# Altium project DataLoger.PrjPcb
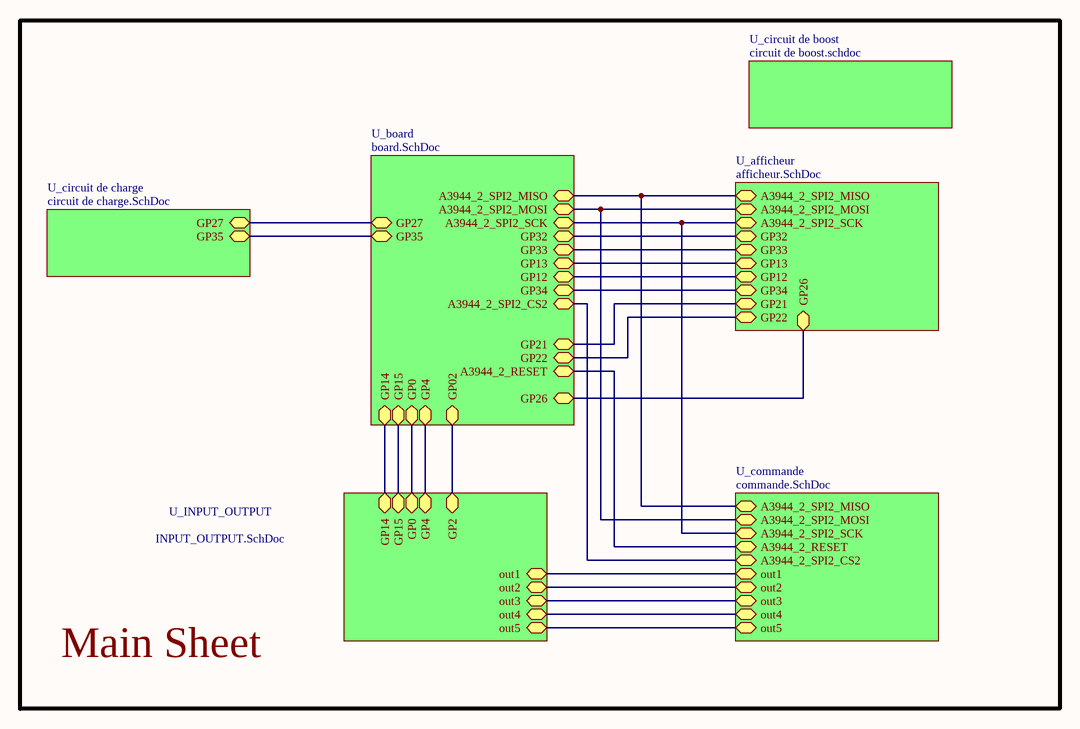
[diagram p0: main.SchDoc]
7 sheets, 81 parts. Net scope: hierarchical (ports join the sheet entries above them; power ports are global).
Board file: PCB final (2).PcbDoc
Sheets:
  main.SchDoc
    U_circuit de boost = circuit de boost.schdoc
    U_board = board.SchDoc
    U_circuit de charge = circuit de charge.SchDoc
    U_INPUT_OUTPUT = INPUT_OUTPUT.SchDoc
    U_commande = commande.SchDoc
    U_afficheur = afficheur.SchDoc

## Sheet main.SchDoc
size A4; SheetNumber: 1; SheetTotal: 7

### Sub-sheets
U_afficheur = afficheur.SchDoc: A3944_2_SPI2_MISO (bidir), A3944_2_SPI2_MOSI (bidir), A3944_2_SPI2_SCK (bidir), GP32 (bidir), GP33 (bidir), GP13 (bidir), GP12 (bidir), GP34 (bidir), GP21 (bidir), GP22 (bidir), GP26 (bidir)
U_board = board.SchDoc: A3944_2_SPI2_MOSI (bidir), GP22 (bidir), GP21 (bidir), A3944_2_SPI2_CS2 (bidir), GP27 (bidir), A3944_2_SPI2_MISO (bidir), A3944_2_SPI2_SCK (bidir), GP4 (bidir), GP0 (bidir), GP14 (bidir), A3944_2_RESET (bidir), GP33 (bidir), GP32 (bidir), GP34 (bidir), GP12 (bidir), GP13 (bidir), GP02 (bidir), GP15 (bidir), GP35 (bidir), GP26 (bidir)
U_circuit de boost = circuit de boost.schdoc: no entries
U_circuit de charge = circuit de charge.SchDoc: GP27 (bidir), GP35 (bidir)
U_commande = commande.SchDoc: A3944_2_RESET (bidir), A3944_2_SPI2_MISO (bidir), A3944_2_SPI2_SCK (bidir), A3944_2_SPI2_MOSI (bidir), A3944_2_SPI2_CS2 (bidir), out1 (bidir), out2 (bidir), out3 (bidir), out4 (bidir), out5 (bidir)
U_INPUT_OUTPUT = INPUT_OUTPUT.SchDoc: GP15 (bidir), GP14 (bidir), GP4 (bidir), GP0 (bidir), out1 (bidir), out2 (bidir), out3 (bidir), out4 (bidir), out5 (bidir), GP2 (bidir)

### Nets
A3944_2_SPI2_MISO: sheet U_board/A3944_2_SPI2_MISO, sheet U_commande/A3944_2_SPI2_MISO, sheet U_afficheur/A3944_2_SPI2_MISO
A3944_2_SPI2_MOSI: sheet U_board/A3944_2_SPI2_MOSI, sheet U_commande/A3944_2_SPI2_MOSI, sheet U_afficheur/A3944_2_SPI2_MOSI
A3944_2_SPI2_SCK: sheet U_board/A3944_2_SPI2_SCK, sheet U_commande/A3944_2_SPI2_SCK, sheet U_afficheur/A3944_2_SPI2_SCK
GP35: sheet U_board/GP35, sheet U_circuit de charge/GP35
out1: sheet U_INPUT_OUTPUT/out1, sheet U_commande/out1
out2: sheet U_INPUT_OUTPUT/out2, sheet U_commande/out2
out3: sheet U_INPUT_OUTPUT/out3, sheet U_commande/out3
out4: sheet U_INPUT_OUTPUT/out4, sheet U_commande/out4
out5: sheet U_INPUT_OUTPUT/out5, sheet U_commande/out5
NetB5_2: sheet U_board/GP26, sheet U_afficheur/GP26
NetJ1_2: sheet U_board/GP15, sheet U_INPUT_OUTPUT/GP15
NetJ2_2: sheet U_board/GP14, sheet U_INPUT_OUTPUT/GP14
NetJ3_2: sheet U_board/GP02, sheet U_INPUT_OUTPUT/GP2
NetJ4_2: sheet U_board/GP4, sheet U_INPUT_OUTPUT/GP4
NetJ5_2: sheet U_board/GP0, sheet U_INPUT_OUTPUT/GP0
NetP1_A1: sheet U_board/GP22, sheet U_afficheur/GP22
NetP1_B1: sheet U_board/GP32, sheet U_afficheur/GP32
NetP1_B4: sheet U_board/GP33, sheet U_afficheur/GP33
NetP1_B10: sheet U_board/GP21, sheet U_afficheur/GP21
NetP1_B11: sheet U_board/GP34, sheet U_afficheur/GP34
NetP1_B12: sheet U_board/GP12, sheet U_afficheur/GP12
NetR40_2: sheet U_board/GP13, sheet U_afficheur/GP13
NetR54_1: sheet U_board/GP27, sheet U_circuit de charge/GP27
NetU4_23: sheet U_board/A3944_2_SPI2_CS2, sheet U_commande/A3944_2_SPI2_CS2
NetU4_27: sheet U_board/A3944_2_RESET, sheet U_commande/A3944_2_RESET

### Notes on the sheet
- Labels drawn without touching a wire or pin: Main Sheet

## Sheet circuit de boost.schdoc
size A4; SheetNumber: 7; SheetTotal: 7
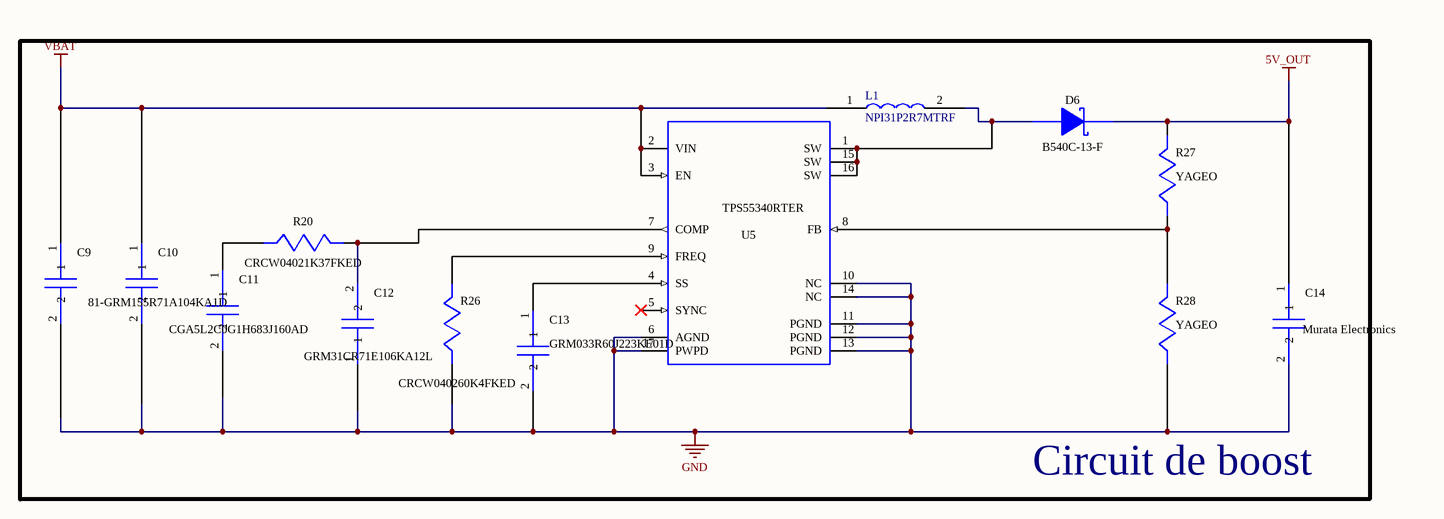
[diagram p1: circuit de boost.schdoc]

### Parts
C9  GRM31CR71E106KA12L  [GRM31CR71E106KA12L]  (value not drawn)
C10  Supplier réf: 81-GRM155R71A104KA1D  [GRM155R71A104KA01D]  (hidden comment: GRM155R71A104KA01D)
C11  CGA5L2C0G1H683J160AD  [CGA5L2C0G1H683J160AD]
C12  Mfr réf: GRM31CR71E106KA12L  [GRM2195C1H152JA01L]  (hidden comment: GRM2195C1H152JA01D)
C13  GRM033R60J223KE01D  [GRM033R60J223KE01D]
C14  Mfr: Murata Electronics  [GRM32EC80J107ME20L]  (hidden comment: GRM32EC80J107ME20L)
D6  B540C-13-F  [B540C-13-F]
L1  NPI31P2R7MTRF  [NPI31P2R7MTRF]
R20  CRCW04021K37FKED  [CRCW04021K37FKED]
R26  CRCW040260K4FKED  [CRCW040260K4FKED]
R27  Mfr: YAGEO  [RT0805BRD0730K5L]  (hidden comment: RT0805BRD0730K5L)
R28  Mfr: YAGEO  [RC0201FR-0710KL]  (hidden comment: RC0201FR-0710KL)
U5  TPS55340RTER  [TPS55340RTER]

### Blocks framed on the sheet
Circuit de boost: C9-C14 D6 L1 R20 R26-R28 U5

### Nets
5V_OUT: C14.1 D6.1(K) R27.1
GND: C9.2 C10.2 C11.2 C12.1 C13.2 C14.2 R26.2 R28.2 U5.6(AGND) U5.10(NC) U5.11(PGND) U5.12(PGND) U5.13(PGND) U5.14(NC) U5.17(PWPD)
VBAT: C9.1 C10.1 L1.1 U5.2(VIN) U5.3(EN)
NetC11_1: C11.1 R20.2
NetC12_2: C12.2 R20.1 U5.7(COMP)
NetC13_1: C13.1 U5.4(SS)
NetD6_2: D6.2(A) L1.2 U5.1(SW) U5.15(SW) U5.16(SW)
NetR26_1: R26.1 U5.9(FREQ)
NetR27_2: R27.2 R28.1 U5.8(FB)

Not connected (* = marked no-connect by the designer): U5 5(SYNC)*

### Library data of the parts
C9 = GRM31CR71E106KA12L: Multilayer Ceramic Capacitors MLCC - SMD/SMT 10 uF 25 VDC 10% 1206 X7R; Mfr: MuRata; Mfr réf: GRM31CR71E106KA12L; Supplier: Mouser; Supplier réf: 81-GRM31CR71E106KA12; Footprint: C1206; Price: 0.29$
C10 = GRM155R71A104KA01D: Multilayer Ceramic Capacitors MLCC - SMD/SMT 0.1 uF 10 VDC 10% 0402 X7R; Mfr: Murata; Mfr réf: GRM155R71A104KA01D; Supplier: mouser; Price: 0.09$
C11 = CGA5L2C0G1H683J160AD: Multilayer Ceramic Capacitors MLCC - SMD/SMT 1206 50V 0.068uF C0G 5% AEC-Q200 EPXY; Mfr: TDK; Supplier: mouser; Supplier réf: 810-CGA5L2C0G1H683JD; Mfr réf: CGA5L2C0G1H683J160AD; Footprint: *; Price: 0.73$
C12 = GRM2195C1H152JA01D: Multilayer Ceramic Capacitors MLCC - SMD/SMT 10 uF 25 VDC 10% 1206 X7R; Mfr: MuRata; Supplier: mouser; Supplier réf: 490-6518-6-ND; Price: 0.29$
C13 = GRM033R60J223KE01D: Multilayer Ceramic Capacitors MLCC - SMD/SMT 0.022 uF 6.3 VDC 10% 0201 X5R; Mfr: MuRata; Supplier: Mouser; Supplier réf: 81-GRM033R60J223KE1D; Mfr réf: GRM033R60J223KE01D; Price: 0.09$
C14 = GRM32EC80J107ME20L: Multilayer Ceramic Capacitors MLCC - SMD/SMT 100 uF 6.3 VDC 20% 1210 X6S; Supplier: Mouser; Supplier réf: 81-GRM32EC80J107ME0L; Mfr réf: GRM32EC80J107ME20L; Footprint: C1210; Price: 1.33$
D6 = B540C-13-F: Schottky Diodes & Rectifiers 40V 5A; Mfr: Diodes Incorporated; Supplier: Mouser; Supplier réf: 621-B540C-F; Mfr réf: B540C-13-F; Footprint: B540C; Price: 0.43$
L1 = NPI31P2R7MTRF: Power Inductor (SMD), 2.7 uH, ± 20%, 6.6 A, Unshielded, 7 A, 13.2mm x 9.9mm x 6.4mm; Mfr: NIC; Supplier: Exshine Technology; Supplier réf: EX-NPI31P2R7MTRF; Mfr réf: NPI31P2R7MTRF; Price: 0.37$
R20 = CRCW04021K37FKED: Thick Film Resistors - SMD 1/16watt 1.37Kohms 1%; Mfr: Vishay Dale; Supplier: mouser; Supplier réf: 71-CRCW0402-1.37K-E3; Mfr réf: CRCW04021K37FKED; Price: 0.093$
R26 = CRCW040260K4FKED: Thick Film Resistors - SMD 1/16watt 60.4Kohms 1%; Mfr: Vishay-Dale; Supplier: Digikey; Supplier réf: 541-60.4KLDKR-ND; Mfr réf: CRCW040260K4FKED; Price: 0.10$
R27 = RT0805BRD0730K5L: Thin Film Resistors - SMD 1/8W 30.5K Ohms 0.1%; Supplier: Mouser; Supplier réf: 603-RT0805BRD0730K5L; Mfr réf: RT0805BRD0730K5L; Footprint: R0805; Price: 0.15$
R28 = RC0201FR-0710KL: Thick Film Resistors - SMD 10 kOhms 50mW 0201 1%; Supplier: mouser; Supplier réf: 603-RC0201FR-0710KL; Mfr réf: RC0201FR-0710KL; Footprint: RC0201; Price: 0.09$
U5 = TPS55340RTER: Switching Voltage Regulators 5A 40V Wide In Range DC-DC Converter; Mfr: Texas Instruments; Supplier réf: 595-TPS55340RTER; Mfr réf: TPS55340RTER; Price: 15$

## Sheet board.SchDoc
size A4; SheetNumber: 2; SheetTotal: 7
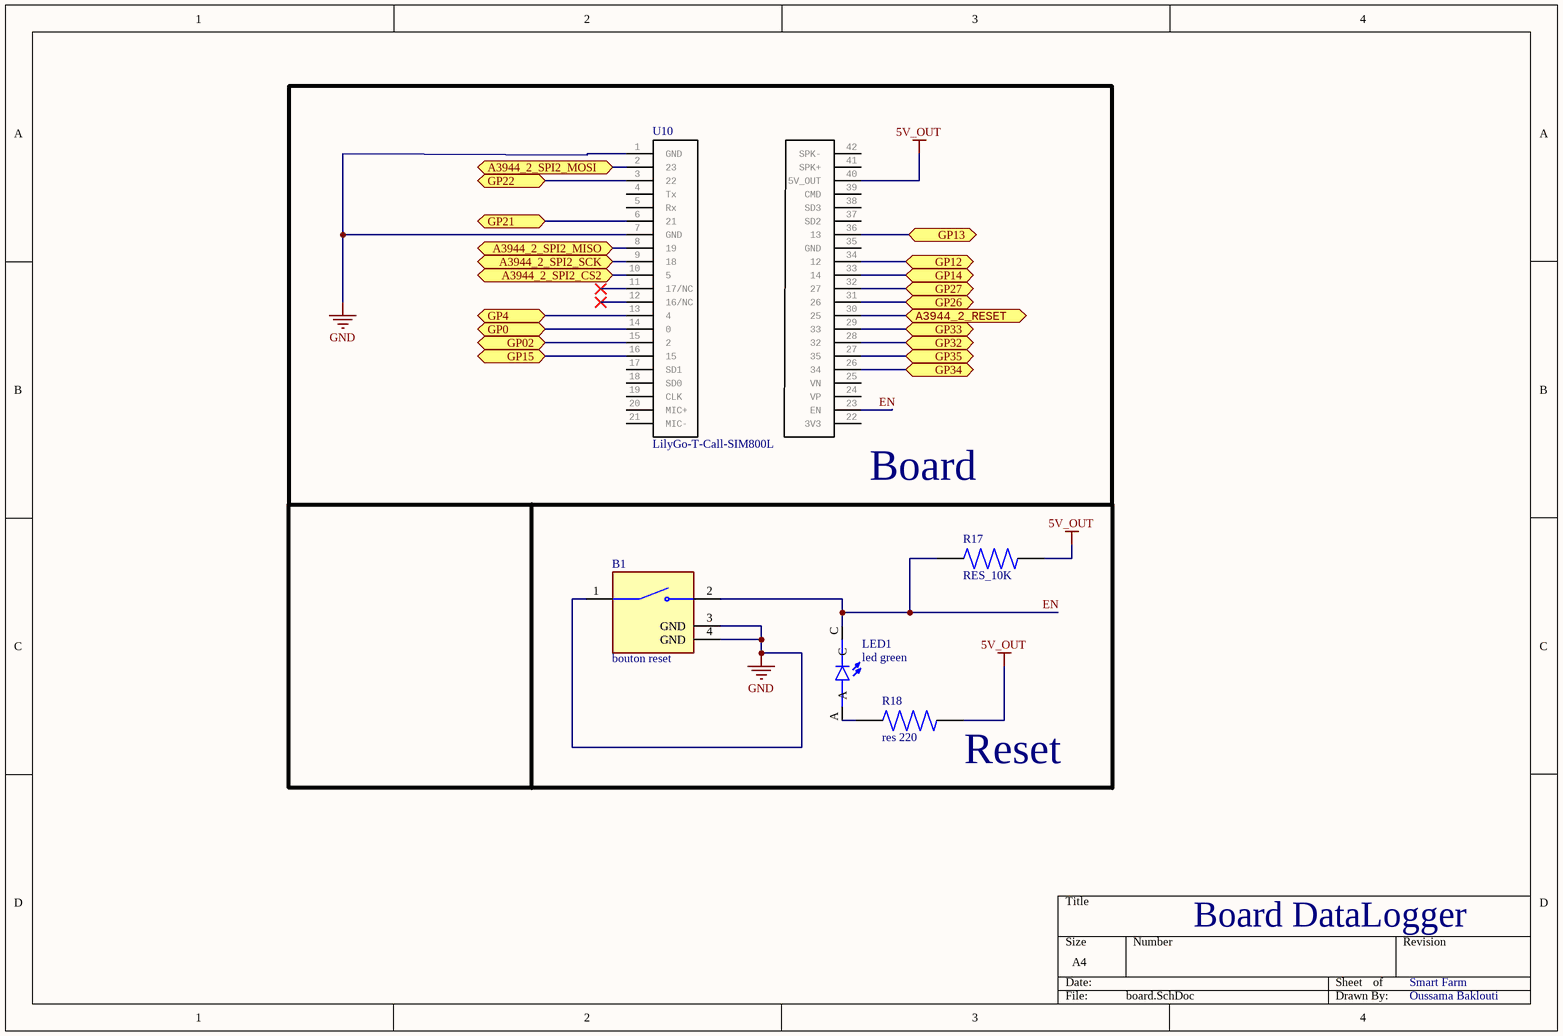
[diagram p2: board.SchDoc]

### Parts
B1  bouton reset  [button]
LED1  led green  [led green]
R17  RES_10K  [RES_10k]
R18  res 220  [res 220]
U10  LilyGo-T-Call-SIM800L  [LilyGo-T-Call-SIM800L]

### Blocks framed on the sheet
Board: U10

### Ports
A3944_2_RESET (bidir), A3944_2_SPI2_CS2 (bidir), A3944_2_SPI2_MISO (bidir), A3944_2_SPI2_MOSI (bidir), A3944_2_SPI2_SCK (bidir), GP0 (bidir), GP02 (bidir), GP4 (bidir), GP12 (bidir), GP13 (bidir), GP14 (bidir), GP15 (bidir), GP21 (bidir), GP22 (bidir), GP26 (bidir), GP27 (bidir), GP32 (bidir), GP33 (bidir), GP34 (bidir), GP35 (bidir)

### Nets
5V_OUT: R17.2 R18.2 U10.40(5V_OUT)
GND: B1.1(COM) B1.3(GND) B1.4(GND) U10.1(GND) U10.7(GND)
A3944_2_SPI2_MISO: U10.8(19) ; port A3944_2_SPI2_MISO
A3944_2_SPI2_MOSI: U10.2(23) ; port A3944_2_SPI2_MOSI
A3944_2_SPI2_SCK: U10.9(18) ; port A3944_2_SPI2_SCK
EN: B1.2(NO) LED1.C R17.1 U10.23(EN)
GP35: U10.27(35) ; port GP35
NetB5_2: U10.31(26) ; port GP26
NetJ1_2: U10.16(15) ; port GP15
NetJ2_2: U10.33(14) ; port GP14
NetJ3_2: U10.15(2) ; port GP02
NetJ4_2: U10.13(4) ; port GP4
NetJ5_2: U10.14(0) ; port GP0
NetLED1_A: LED1.A R18.1
NetP1_A1: U10.3(22) ; port GP22
NetP1_B1: U10.28(32) ; port GP32
NetP1_B4: U10.29(33) ; port GP33
NetP1_B10: U10.6(21) ; port GP21
NetP1_B11: U10.26(34) ; port GP34
NetP1_B12: U10.34(12) ; port GP12
NetR40_2: U10.36(13) ; port GP13
NetR54_1: U10.32(27) ; port GP27
NetU4_23: U10.10(5) ; port A3944_2_SPI2_CS2
NetU4_27: U10.30(25) ; port A3944_2_RESET

Not connected (* = marked no-connect by the designer): U10 4(Tx) 5(Rx) 11(17/NC)* 12(16/NC)* 17(SD1) 18(SD0) 19(CLK) 20(MIC+) 21(MIC-) 22(3V3) 24(VP) 25(VN) 35(GND) 37(SD2) 38(SD3) 39(CMD) 41(SPK+) 42(SPK-)

### Notes on the sheet
- (near R18) Reset
- Board DataLogger
- Smart Farm
- Oussama Baklouti

### Library data of the parts
B1 = bouton reset: Mfr: CUI Devices; Mfr réf: TS11-674-120-BK-260-RA-D; Supplier: DigiKey; Supplier réf: 2223-TS11-674-120-BK-260-RA-D-ND
LED1 = led green: Mfr: Lumex Opto/Components Inc.; Mfr réf: SSF-LXH305GD-TR; Supplier: DigiKey; Supplier réf: 67-1375-6-ND
R17 = RES_10K: Thick Film Resistors - SMD ResHighPowerA 0805 10k 1% 1/2W TC100; Mfr: Bourns Inc.; Mfr réf: CMP0805AFX-1002ELF; Supplier: Mouser; Supplier réf: 652-CMP0805AFX-1002L; Footprint: R0805
R18 = res 220: Thick Film Resistors - SMD 1/2watt 220ohms 1% High Power AEC-Q200; Mfr: Vishay Dale; Mfr Réf: CRCW0805220RFKEAHP; Supplier: Mouser; Supplier réf: 71-CRCW0805220RFKEAH; Footprint: R0805
U10 = LilyGo-T-Call-SIM800L: ESP32 Wireless Module GPRS Antenna SIM Card SIM800L Module

## Sheet circuit de charge.SchDoc
size A4; SheetNumber: 3; SheetTotal: 7
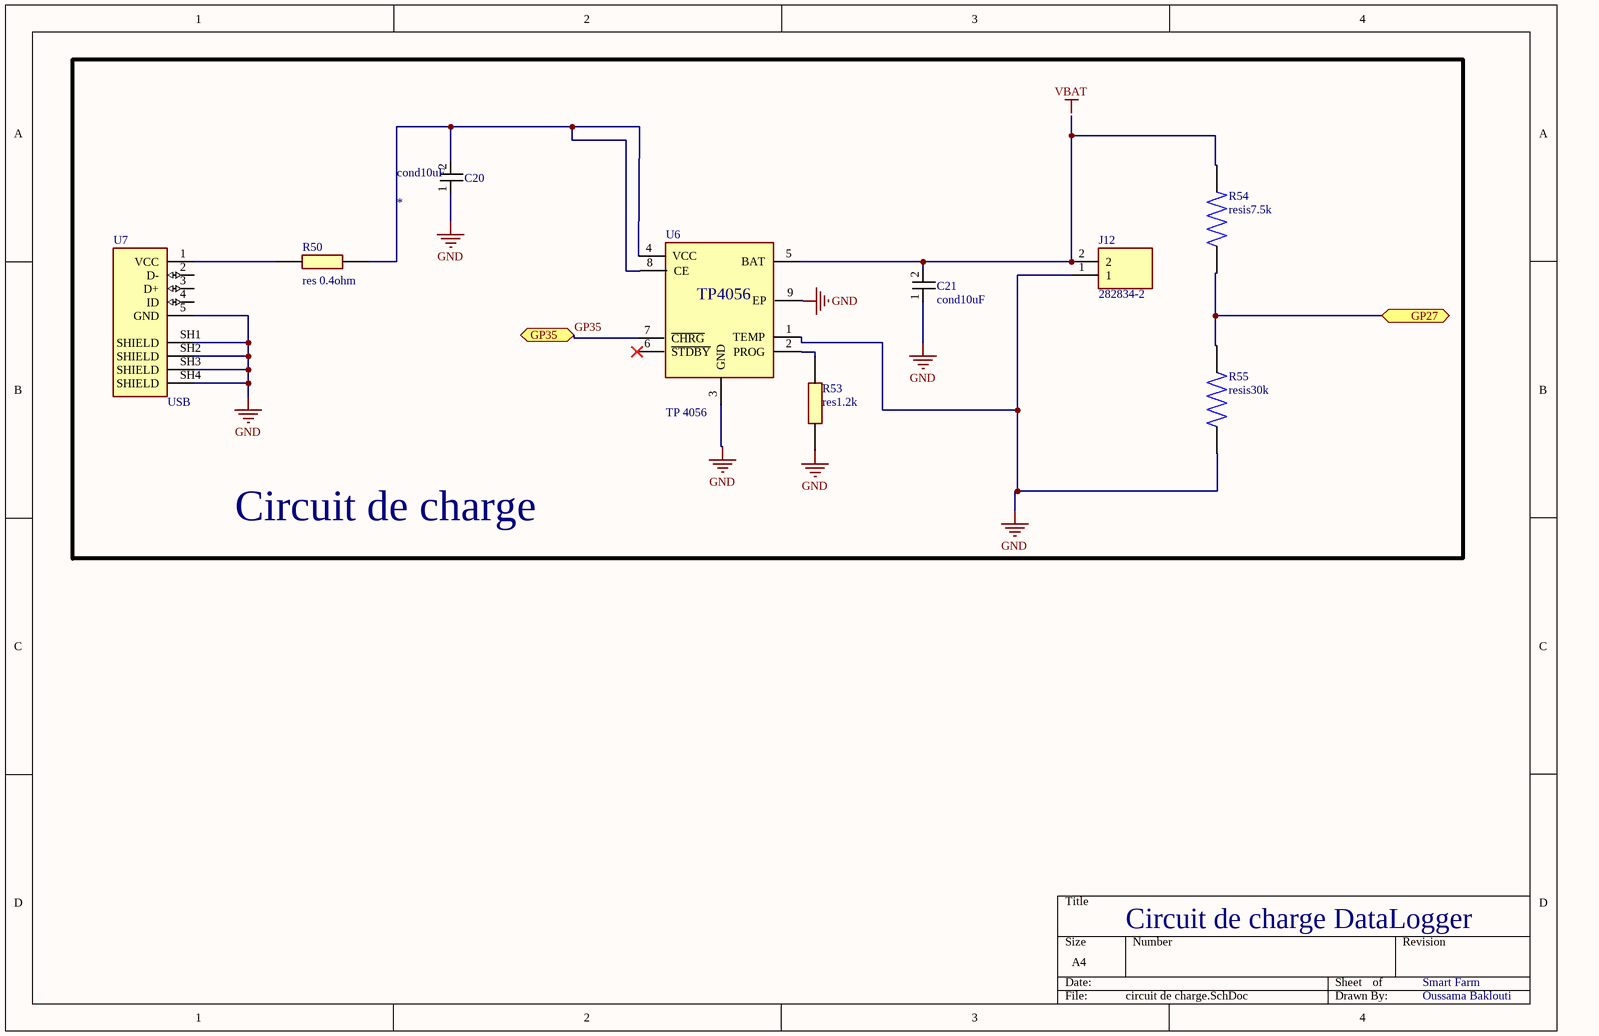
[diagram p3: circuit de charge.SchDoc]

### Parts
C20  cond10uF  [cond10uF]
C21  cond10uF  [cond10uF]
J12  282834-2  [282834-2]
R50  (no value)  [res0.4]
R53  res1.2k  [res1.2k]
R54  resis7.5k  [res7.5k]
R55  resis30k  [res30k]
U6  TP 4056  [TP4056]
U7  (no value)  [USB]

### Blocks framed on the sheet
Circuit de charge: C20 C21 J12 R50 R53-R55 U6 U7

### Ports
GP27 (bidir), GP35 (bidir)

### Nets
GND: C20.1 C21.1 J12.1 R53.1 R55.1 U6.1(TEMP) U6.3(GND) U6.9(EP) U7.5(GND) U7.SH1(SHIELD) U7.SH2(SHIELD) U7.SH3(SHIELD) U7.SH4(SHIELD)
GP35: U6.7(~{CHRG}) ; port GP35
NetC20_2: C20.2 R50.2 U6.4(VCC) U6.8(CE)
NetC21_2: C21.2 J12.2 R54.2 U6.5(BAT)
NetR50_1: R50.1 U7.1(VCC)
NetR53_2: R53.2 U6.2(PROG)
NetR54_1: R54.1 R55.2 ; port GP27

Not connected (* = marked no-connect by the designer): U6 6(~{STDBY})*; U7 2(D-) 3(D+) 4(ID)

### Notes on the sheet
- Circuit de charge DataLogger
- Smart Farm
- Oussama Baklouti
- Labels drawn without touching a wire or pin: VBAT
- (in symbol res0.4) res 0.4ohm
- (in symbol TP 4056) TP4056

### Library data of the parts
C20 = cond10uF: Multilayer Ceramic Capacitors MLCC - SMD/SMT 16V 10uF X7R 1206 10% AEC-Q200; Mfr: KYOCERA AVX; Mfr réf: KAM31GR71C106KU; Suuplier réf: 581-KAM31GR71C106KU; Supplier: Mouser; Parameter 1: *
R50 = res0.4
R54 = resis7.5k: Mfr: YAGEO; Mfr réf: AC0603JR-077K5L; Supplier: DigiKey; Supplier réf: 13-AC0603JR-077K5LDKR-ND
R55 = resis33k: Mfr: YAGEO; Mfr réf: AC0603JR-0733KL; Supplier: DigiKey; Supplier réf: YAG3665DKR-ND
U7 = USB: USB - micro B USB 2.0 Receptacle Connector 5 Position Surface Mount, Right Angle; Mfr: Amphenol ICC (FCI); Mfr Réf: 10104110-0001LF; Supplier: DigiKey; Supplier Réf: 609-4052-6-ND; Footprint: CONN RCPT USB2.0 MICRO B; Price: $0.84

## Sheet INPUT_OUTPUT.SchDoc
size A4; SheetNumber: 6; SheetTotal: 7
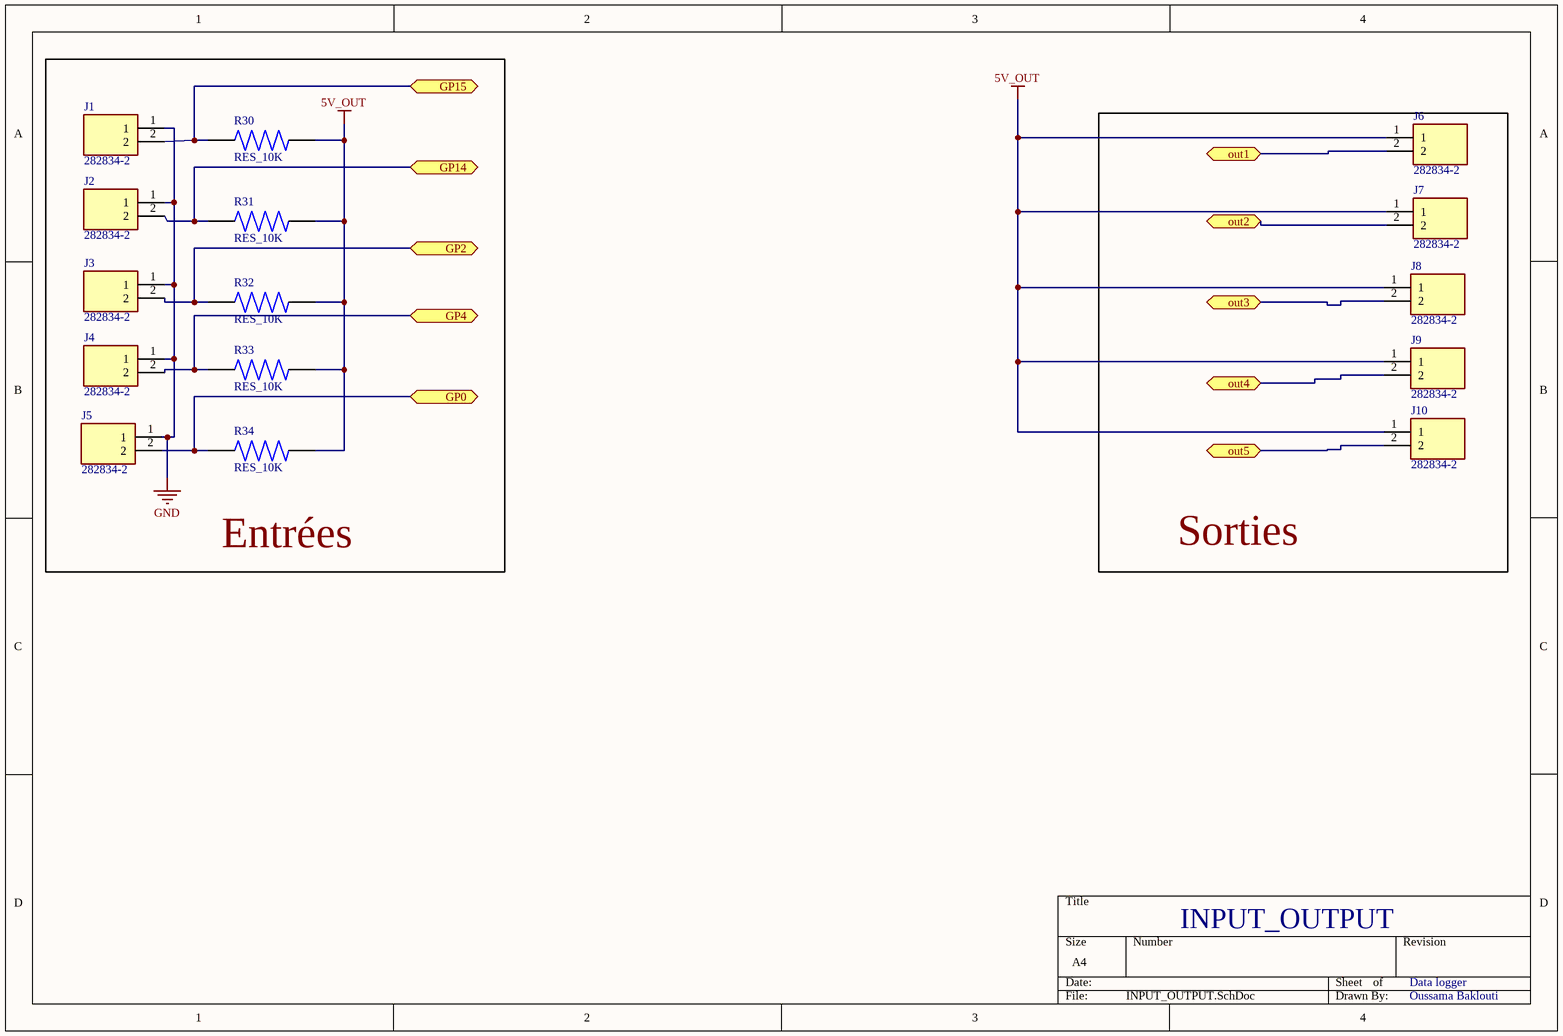
[diagram p4: INPUT_OUTPUT.SchDoc]

### Parts
J1  282834-2  [282834-2]
J2  282834-2  [282834-2]
J3  282834-2  [282834-2]
J4  282834-2  [282834-2]
J5  282834-2  [282834-2]
J6  282834-2  [282834-2]
J7  282834-2  [282834-2]
J8  282834-2  [282834-2]
J9  282834-2  [282834-2]
J10  282834-2  [282834-2]
R30  RES_10K  [RES_10k]
R31  RES_10K  [RES_10k]
R32  RES_10K  [RES_10k]
R33  RES_10K  [RES_10k]
R34  RES_10K  [RES_10k]

### Ports
GP0 (bidir), GP2 (bidir), GP4 (bidir), GP14 (bidir), GP15 (bidir), out1 (bidir), out2 (bidir), out3 (bidir), out4 (bidir), out5 (bidir)

### Nets
5V_OUT: J6.1 J7.1 J8.1 J9.1 J10.1 R30.2 R31.2 R32.2 R33.2 R34.2
GND: J1.1 J2.1 J3.1 J4.1 J5.1
out1: J6.2 ; port out1
out2: J7.2 ; port out2
out3: J8.2 ; port out3
out4: J9.2 ; port out4
out5: J10.2 ; port out5
NetJ1_2: J1.2 R30.1 ; port GP15
NetJ2_2: J2.2 R31.1 ; port GP14
NetJ3_2: J3.2 R32.1 ; port GP2
NetJ4_2: J4.2 R33.1 ; port GP4
NetJ5_2: J5.2 R34.1 ; port GP0

### Notes on the sheet
- INPUT_OUTPUT
- Data logger
- Oussama Baklouti
- Labels drawn without touching a wire or pin: Entrées, Sorties

### Library data of the parts
J1-J10 = 282834-2: Fixed Terminal Blocks 2P SIDE ENTRY 2.54mm; Mfr: TE Connectivity; Supplier: Mouser; Supplier réf: 571-282834-2; Mfr réf: 282834-2
R30-R34 = RES_10K: Thick Film Resistors - SMD ResHighPowerA 0805 10k 1% 1/2W TC100; Mfr: Bourns; Mfr réf: CMP0805AFX-1002ELF; Supplier: Mouser; Supplier réf: 652-CMP0805AFX-1002L; Footprint: R0805

## Sheet commande.SchDoc
size A4; SheetNumber: 4; SheetTotal: 7
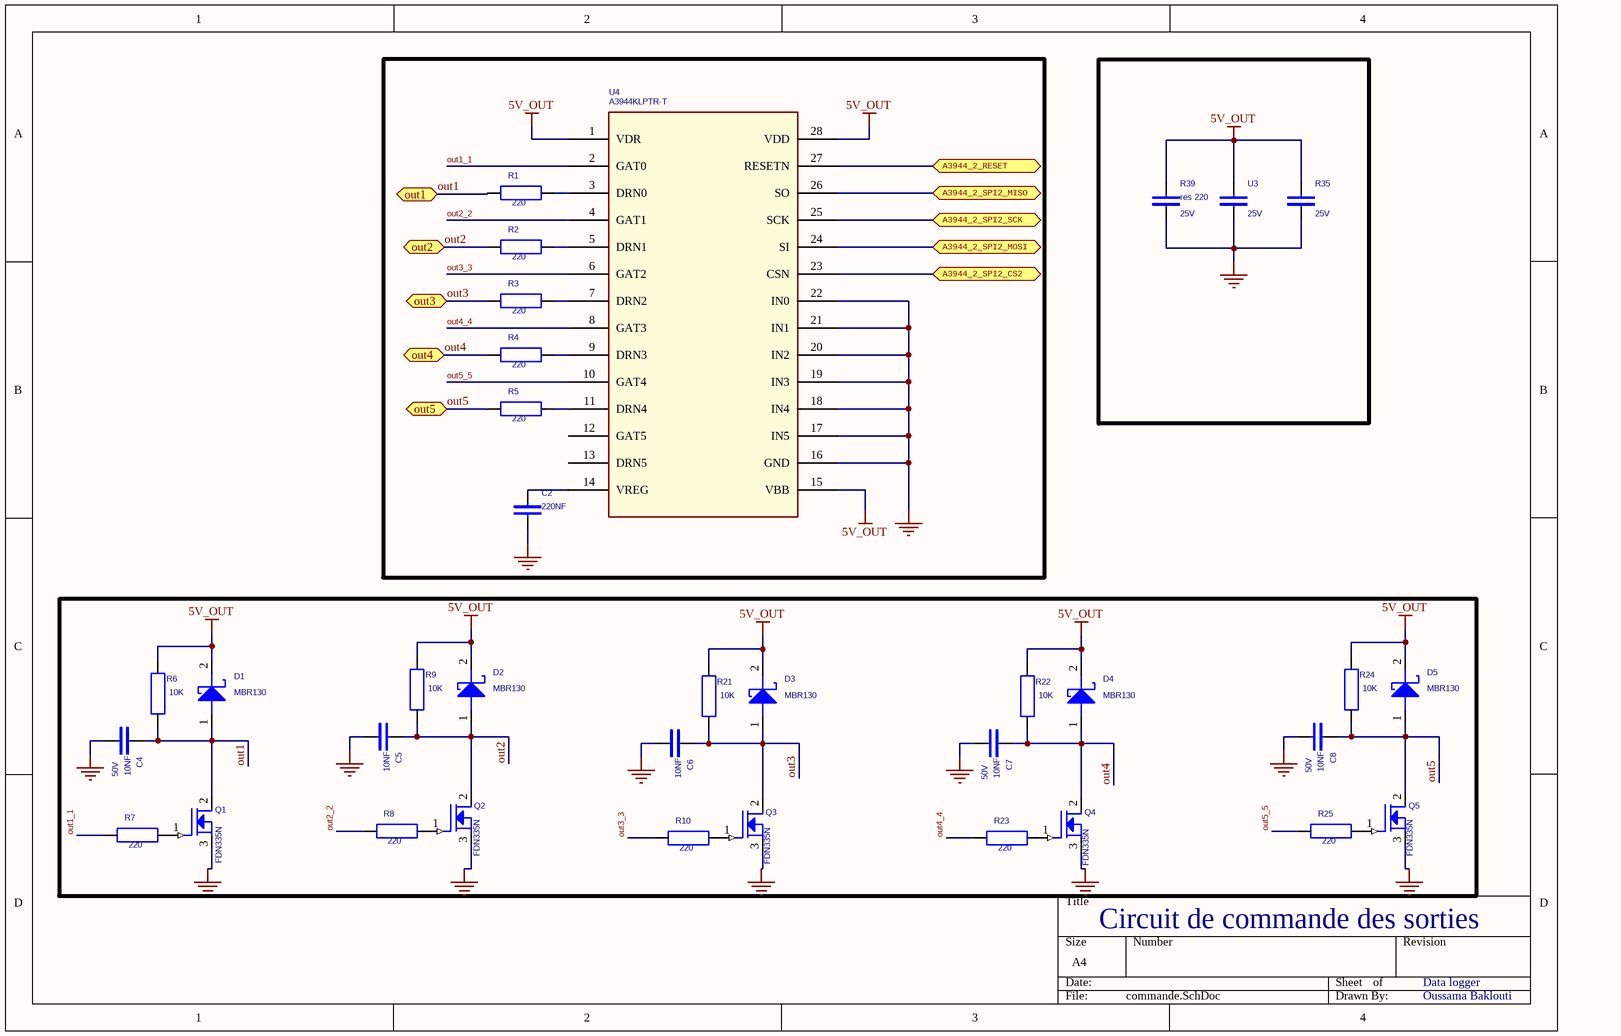
[diagram p5: commande.SchDoc]

### Parts
C2  220NF  [cap 220uF 50v]
C4  10NF  Voltage: 50V  [cap 10nF 50V]
C5  10NF  [cap 10nF 50V]
C6  10NF  [cap 10nF 50V]
C7  10NF  Voltage: 50V  [cap 10nF 50V]
C8  10NF  Voltage: 50V  [cap 10nF 50V]
D1  MBR130  [diode skotty]
D2  MBR130  [diode skotty]
D3  MBR130  [diode skotty]
D4  MBR130  [diode skotty]
D5  MBR130  [diode skotty]
Q1  FDN335N  [FDN335N]
Q2  FDN335N  [FDN335N]
Q3  FDN335N  [FDN335N]
Q4  FDN335N  [FDN335N]
Q5  FDN335N  [FDN335N]
R1  220  [res 220]
R2  220  [res 220]
R3  220  [res 220]
R4  220  [res 220]
R5  220  [res 220]
R6  10K  [RES_10k]
R7  220  [res 220]
R8  220  [res 220]
R9  10K  [RES_10k]
R10  220  [res 220]
R21  10K  [RES_10k]
R22  10K  [RES_10k]
R23  220  [res 220]
R24  10K  [RES_10k]
R25  220  [res 220]
R35  Voltage: 25V  [RES 220]
R39  res 220  Voltage: 25V  [RES 220]
U3  Voltage: 25V  [LILYGO-T-CALL-SIM800L]
U4  A3944KLPTR-T  [SOP65P640X265_HS-29N]

### Ports
A3944_2_RESET (bidir), A3944_2_SPI2_CS2 (bidir), A3944_2_SPI2_MISO (bidir), A3944_2_SPI2_MOSI (bidir), A3944_2_SPI2_SCK (bidir), out1 (bidir), out2 (bidir), out3 (bidir), out4 (bidir), out5 (bidir)

### Nets
5V_OUT: D1.2(K) D2.2(K) D3.2(K) D4.2(K) D5.2(K) R6.1 R9.1 R21.1 R22.1 R24.1 R35.1 R39.1 U3.1 U4.1(VDR) U4.15(VBB) U4.28(VDD)
GND: C2.2 C4.2 C5.2 C6.2 C7.2 C8.2 Q1.3(SOURCE) Q2.3(SOURCE) Q3.3(SOURCE) Q4.3(SOURCE) Q5.3(SOURCE) R35.2 R39.2 U3.2 U4.16(GND) U4.17(IN5) U4.18(IN4) U4.19(IN3) U4.20(IN2) U4.21(IN1) U4.22(IN0)
A3944_2_SPI2_MISO: U4.26(SO) ; port A3944_2_SPI2_MISO
A3944_2_SPI2_MOSI: U4.24(SI) ; port A3944_2_SPI2_MOSI
A3944_2_SPI2_SCK: U4.25(SCK) ; port A3944_2_SPI2_SCK
out1: C4.1 D1.1(A) Q1.2(DRAIN) R1.2 R6.2 ; port out1
out1_1: R7.2 U4.2(GAT0)
out2: C5.1 D2.1(A) Q2.2(DRAIN) R2.2 R9.2 ; port out2
out2_2: R8.2 U4.4(GAT1)
out3: C6.1 D3.1(A) Q3.2(DRAIN) R3.2 R21.2 ; port out3
out3_3: R10.2 U4.6(GAT2)
out4: C7.1 D4.1(A) Q4.2(DRAIN) R4.2 R22.2 ; port out4
out4_4: R23.2 U4.8(GAT3)
out5: C8.1 D5.1(A) Q5.2(DRAIN) R5.2 R24.2 ; port out5
out5_5: R25.2 U4.10(GAT4)
NetC2_1: C2.1 U4.14(VREG)
NetQ1_1: Q1.1(GATE) R7.1
NetQ2_1: Q2.1(GATE) R8.1
NetQ3_1: Q3.1(GATE) R10.1
NetQ4_1: Q4.1(GATE) R23.1
NetQ5_1: Q5.1(GATE) R25.1
NetR1_1: R1.1 U4.3(DRN0)
NetR2_1: R2.1 U4.5(DRN1)
NetR3_1: R3.1 U4.7(DRN2)
NetR4_1: R4.1 U4.9(DRN3)
NetR5_1: R5.1 U4.11(DRN4)
NetU4_23: U4.23(CSN) ; port A3944_2_SPI2_CS2
NetU4_27: U4.27(RESETN) ; port A3944_2_RESET

Not connected (* = marked no-connect by the designer): U4 12(GAT5) 13(DRN5)

### Notes on the sheet
- Circuit de commande des sorties
- Data logger
- Oussama Baklouti

### Library data of the parts
C2 = CAPA_Dup1: Aluminium Electrolytic Capacitors - SMD 50volts 0.22uF AEC-Q200; Mfr: Nichicon; Mfr réf: UWP1HR22MCL1GB; Supplier: Mouser; Supplier réf: 647-UWP1HR22MCL; Price: 0.63$
C4 = CAPA_Dup1: 10000 pF ±10% 50V Ceramic Capacitor X7R 0402 (1005 Metric); Part Number: AY15800014; Manufacturer1: SAMSUNG; Manufacturer Ref1: CL05B103KB5NNND; Part_Type: CAP_0402; Mfr: Murata Electronics; Mfr réf: GRM155R71H103KA88D; ARDIA PN: 11-1522-01; Description2: -55/125C; Description1: C SMD X7R 0402 10nF 50V 10%; OptionFab: /RoHS/260 /0   /0; Standard Price: 0; Annual Usage: 63 251 069; Packing: PCE; Supply family: CAP; PcbFootprint length: 1,7; PcbFootprint Width: 0,6; PcbFootprint Height: 0,55; Manufacturer Ref9: 2238 587 15636'; Manufacturer9: PHYCOMP; Manufacturer Ref8: CL05B103KB5NNNC; Manufacturer8: SAMSUNG; Manufacturer Ref7: CGA2B3X7R1H103K050BB; Manufacturer7: TDK; Manufacturer Ref6: GCM155R71H103KA55D; Manufacturer6: MURATA; Manufacturer Ref5: CC0402KRX7R9BB103; Manufacturer5: YAGEO; Manufacturer Ref4: CL05B103KB5VPNC; Manufacturer4: SAMSUNG; Manufacturer Ref3: C0402C103K5RACTU; Manufacturer3: KEMET; Status: 20; Tolerance: 10%; Type: CERAMIC; Housing: 0402; Stock: 8 686 433; Family: C_COMMON; Manufacturer2: MURATA; Manufacturer Ref2: GRM155R71H103KA88D; Part Order Code: AY15800014; PcbFootprint Pdf: https://view.actiacity.com/alfresco/webdav/CAD_Elec/PCB_footprint_PDF/CNC/S0402%23A.pdf; Supplier: DigiKey; Supplier réf: 490-4516-6-ND
C5 C6 = CAPA_Dup1: 10000 pF ±10% 50V Ceramic Capacitor X7R 0402 (1005 Metric); Mfr: Murata Electronics; Mfr réf: GRM155R71H103KA88D; Supplier: DigiKey; Supplier réf: 490-4516-6-ND
  C6: Price: 0.10$
C7 C8 = CAPA_Dup1: 10000 pF ±10% 50V Ceramic Capacitor X7R 0402 (1005 Metric); Part Number: AY15800014; Manufacturer1: SAMSUNG; Manufacturer Ref1: CL05B103KB5NNND; Part_Type: CAP_0402; Mfr: Murata Electronics; Mfr réf: GRM155R71H103KA88D; ARDIA PN: 11-1522-01; Description2: -55/125C; Description1: C SMD X7R 0402 10nF 50V 10%; OptionFab: /RoHS/260 /0   /0; Standard Price: 0; Annual Usage: 63 251 069; Packing: PCE; Supply family: CAP; PcbFootprint length: 1,7; PcbFootprint Width: 0,6; PcbFootprint Height: 0,55; PcbFootprint PinNumber: 2; PcbFootprint Type: SMD; PcbFootprint Pitch: 1,05; TypeFab: SMD1; Devise: EUR; Manufacturer Ref9: 2238 587 15636'; Manufacturer9: PHYCOMP; Manufacturer Ref8: CL05B103KB5NNNC; Manufacturer8: SAMSUNG; Manufacturer Ref7: CGA2B3X7R1H103K050BB; Manufacturer7: TDK; Manufacturer Ref6: GCM155R71H103KA55D; Manufacturer6: MURATA; Manufacturer Ref5: CC0402KRX7R9BB103; Manufacturer5: YAGEO; Manufacturer Ref4: CL05B103KB5VPNC; Manufacturer4: SAMSUNG; Manufacturer Ref3: C0402C103K5RACTU; Manufacturer3: KEMET; Status: 20; Tolerance: 10%; Type: CERAMIC; Housing: 0402; Stock: 8 686 433; Family: C_COMMON; Manufacturer2: MURATA; Manufacturer Ref2: GRM155R71H103KA88D; Part Order Code: AY15800014; PcbFootprint Pdf: https://view.actiacity.com/alfresco/webdav/CAD_Elec/PCB_footprint_PDF/CNC/S0402%23A.pdf; Not For New Design: 0; Standard Price Devise: 0; Supplier: DigiKey; Supplier réf: 490-4516-6-ND
D1-D5 = DIODE_SCHOT: Schottky Diodes & Rectifiers 1A 30V; Mfr: onsemi; Mfr réf: MBR130T1G; Supplier: Mouser; Supplier réf: 863-MBR130T1G
  D1: Price: 0.31$
Q1-Q5 = MOSFET N: MOSFET SSOT-3 N-CH 20V; Mfr: onsemi / Fairchild; Supplier: Mouser; Supplier réf: 512-FDN335N; Mfr réf: FDN335N
  Q1: Price: 0.40$
R1-R5 R7 R8 R10 R23 R25 = RE: Thick Film Resistors - SMD 1/2watt 220ohms 1% High Power AEC-Q200; Mfr: Vishay / Dale; Mfr réf: CRCW0805220RFKEAHP; Supplier: Mouser; Supplier réf: 71-CRCW0805220RFKEAH; Footprint: R0805
R6 R9 R21 R22 R24 = RE: Thick Film Resistors - SMD ResHighPowerA 0805 10k 1% 1/2W TC100; Mfr: Bourns; Mfr réf: CMP0805AFX-1002ELF; Supplier: Mouser; Supplier réf: 652-CMP0805AFX-1002L; Footprint: R0805
R35 U3 = CAPA_Dup1: Part Order Code: AY15620002; Part_Type: CAP_0603; Manufacturer Ref10: CL10B104KA85PNC; Manufacturer10: SAMSUNG; Manufacturer Ref1: CC0603KRX7R8BB104; Manufacturer1: YAGEO; Devise: EUR; Standard Price Devise: 0; TypeFab: SMD1; PcbFootprint Pitch: 1,38; PcbFootprint Type: SMD; PcbFootprint PinNumber: 2; PcbFootprint Height: 1; PcbFootprint Width: 1,1; PcbFootprint length: 2,3; Specification: 02/07/03 FOOTPRINT : S0603  DEVIENT  S0603R**************ATTENTION COMPOSANT AERONAUTIQUE**************         AJOUT REF FAB  TDK : C1608 X7R1H104 KT         AJOUT REF FAB  SAMSUNG : CL10B104KBNC*   CES COMPOSANTS DOIVENT ETRE LIVRES ACCOMPAGNES D''UN; Supply family: CAP; Packing: PCE; Annual Usage: 12 962 659; OptionFab: /RoHS/260 /0   /0; Description1: C SMD X7R 0603 100nF 25V 10%; Tolerance: 10%; ARDIA PN: 11-1525-01; Not For New Design: 0; PcbFootprint Pdf: https://view.actiacity.com/alfresco/webdav/CAD_Elec/PCB_footprint_PDF/CNC/S0603R%23A.pdf; Manufacturer Ref9: C0603T104K3RACTU; Manufacturer9: KEMET; Manufacturer Ref8: CGA3E2X7R1E104K080AA; Manufacturer8: TDK; Manufacturer Ref7: HMK107B7104KA-T; Manufacturer7: TAIYO YUDE; Manufacturer Ref6: TMK107B7104KAHT; Manufacturer6: TAIYO YUDE; Manufacturer Ref5: TMF107B7104KAHT; Manufacturer5: TAIYO YUDE; Manufacturer Ref4: C0603C104K5RAC7411; Manufacturer4: KEMET; Manufacturer Ref3: GRM188R71E104KA01J; Manufacturer3: MURATA; Manufacturer Ref2: GRM188R71E104KA01D; Manufacturer2: MURATA; Family: C_COMMON; Stock: 107 520; Standard Price: 0; Housing: 0603; Type: CERAMIC; Status: 20; Part Number: AY15620002
R39 = CAPA_Dup1: Part Order Code: AY15510021; Part_Type: CAP_0805; Manufacturer Ref10: CL21A475KAQNNNG; Manufacturer10: SAMSUNG; Manufacturer Ref1: CL21A475KAQNNNE; Devise: EUR; Standard Price Devise: 0; TypeFab: SMD1; PcbFootprint Pitch: 1,8; PcbFootprint Type: SMD; PcbFootprint PinNumber: 2; PcbFootprint Height: 0,95; PcbFootprint Width: 1,6; PcbFootprint length: 3; Specification: estimation Clef a confirmer; Supply family: CAP; Packing: PCE; Annual Usage: 2 324 678; OptionFab: /SPb /260 /1   /0; Description1: C SMD X5R 0805 4.7uF 25V 10%; Tolerance: 10%; ARDIA PN: 11-1504-01; Not For New Design: 0; PcbFootprint Pdf: https://view.actiacity.com/alfresco/webdav/CAD_Elec/PCB_footprint_PDF/CNC/S0805R%23A.pdf; Manufacturer Ref9: CC0805KKX7R8BB475; Manufacturer9: YAGEO; Manufacturer Ref8: 0805X475K100CT; Manufacturer8: WALSIN; Manufacturer Ref7: CGA4J3X5R1V475K125AB; Manufacturer7: TDK; Manufacturer Ref6: CGA4J3X5R1E475K125AB; Manufacturer6: TDK; Manufacturer Ref5: TMK212BBJ475KGHT; Manufacturer5: TAIYO YUDE; Manufacturer Ref4: TMK212AB7475KG-T; Manufacturer4: TAIYO YUDE; Manufacturer Ref3: TMK212ABJ475KG-T; Manufacturer3: TAIYO YUDE; Manufacturer Ref2: 08053D475KAT2A; Manufacturer2: AVX; Manufacturer1: SAMSUNG; Family: C_COMMON; Stock: 72 862; Standard Price: 0; Housing: 0805; Type: CERAMIC; Status: 20; Part Number: AY15510021
U4 = A3944KLPTR-T: Motor/Motion/Ignition Controllers & Drivers AUTOMOTIVE SIX CHANNEL LOW SIDE MOSFET PRE-DRIVER; Mfr: Mfr.:Allegro MicroSystems; Supplier: Mouser; Supplier réf: 250-A3944KLPTR-T; Mfr réf: A3944KLPTR-T; Price: 2.67$

## Sheet afficheur.SchDoc
size A4; SheetNumber: 5; SheetTotal: 7
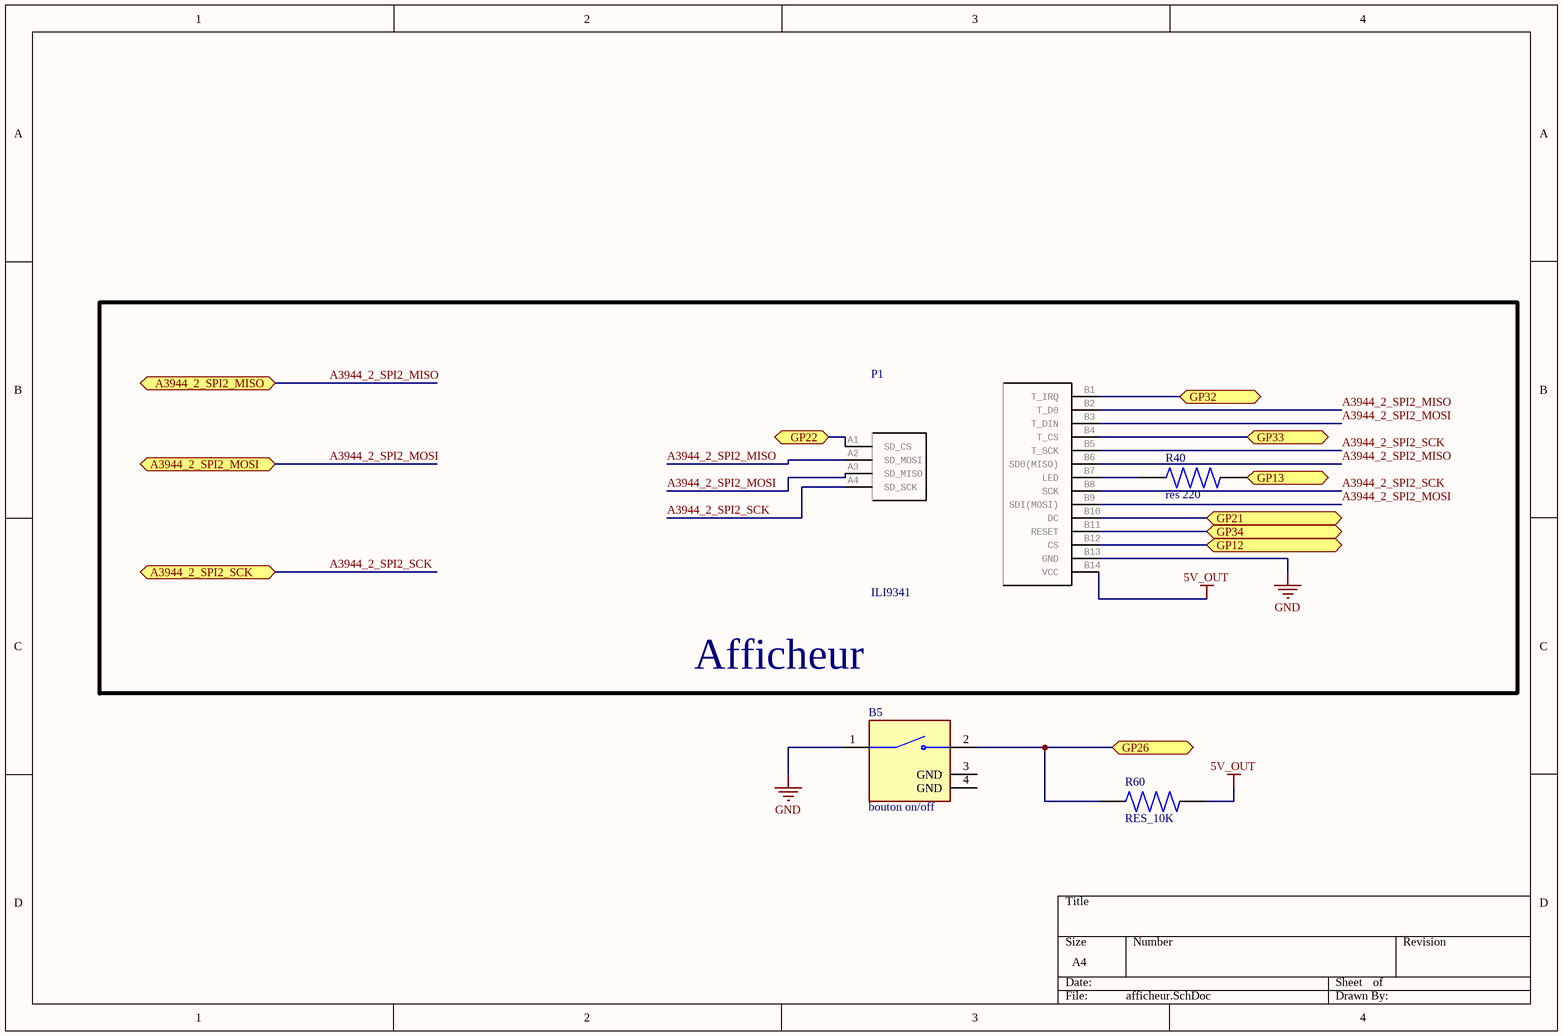
[diagram p6: afficheur.SchDoc]

### Parts
B5  bouton on/off  [button]
P1  ILI9341  [ILI9341]
R40  res 220  [res 220]
R60  RES_10K  [RES_10k]

### Blocks framed on the sheet
Afficheur: P1 R40

### Ports
A3944_2_SPI2_MISO (bidir), A3944_2_SPI2_MOSI (bidir), A3944_2_SPI2_SCK (bidir), GP12 (bidir), GP13 (bidir), GP21 (bidir), GP22 (bidir), GP26 (bidir), GP32 (bidir), GP33 (bidir), GP34 (bidir)

### Nets
5V_OUT: P1.B14(VCC) R60.2
GND: B5.1(COM) P1.B13(GND)
A3944_2_SPI2_MISO: P1.A2(SD_MOSI) P1.B2(T_D0) P1.B6(SD0(MISO)) ; port A3944_2_SPI2_MISO
A3944_2_SPI2_MOSI: P1.A3(SD_MISO) P1.B3(T_DIN) P1.B9(SDI(MOSI)) ; port A3944_2_SPI2_MOSI
A3944_2_SPI2_SCK: P1.A4(SD_SCK) P1.B5(T_SCK) P1.B8(SCK) ; port A3944_2_SPI2_SCK
NetB5_2: B5.2(NO) R60.1 ; port GP26
NetP1_A1: P1.A1(SD_CS) ; port GP22
NetP1_B1: P1.B1(T_IRQ) ; port GP32
NetP1_B4: P1.B4(T_CS) ; port GP33
NetP1_B7: P1.B7(LED) R40.1
NetP1_B10: P1.B10(DC) ; port GP21
NetP1_B11: P1.B11(RESET) ; port GP34
NetP1_B12: P1.B12(CS) ; port GP12
NetR40_2: R40.2 ; port GP13

Not connected (* = marked no-connect by the designer): B5 3(GND) 4(GND)

### Library data of the parts
B5 = bouton reset: as B1 on sheet board; Supplier: DigiKey; Supplier réf: 2223-TS11-674-120-BK-260-RA-D-ND
R60 = RES_10K: as R17 on sheet board; Supplier: Mouser; Supplier réf: 652-CMP0805AFX-1002L; Footprint: R0805

## Nets that join several sheets
5V_OUT: circuit de boost (C14.1 D6.1 R27.1), board (R17.2 R18.2 U10.40), INPUT_OUTPUT (10 pins), commande (16 pins), afficheur (P1.B14 R60.2)
GND: circuit de boost (15 pins), board (5 pins), circuit de charge (13 pins), INPUT_OUTPUT (5 pins), commande (21 pins), afficheur (B5.1 P1.B13)
A3944_2_SPI2_MISO: board (U10.8), commande (U4.26), afficheur (P1.A2 P1.B2 P1.B6)
A3944_2_SPI2_MOSI: board (U10.2), commande (U4.24), afficheur (P1.A3 P1.B3 P1.B9)
A3944_2_SPI2_SCK: board (U10.9), commande (U4.25), afficheur (P1.A4 P1.B5 P1.B8)
GP35: board (U10.27), circuit de charge (U6.7)
NetB5_2: board (U10.31), afficheur (B5.2 R60.1)
NetJ1_2: board (U10.16), INPUT_OUTPUT (J1.2 R30.1)
NetJ2_2: board (U10.33), INPUT_OUTPUT (J2.2 R31.1)
NetJ3_2: board (U10.15), INPUT_OUTPUT (J3.2 R32.1)
NetJ4_2: board (U10.13), INPUT_OUTPUT (J4.2 R33.1)
NetJ5_2: board (U10.14), INPUT_OUTPUT (J5.2 R34.1)
NetP1_A1: board (U10.3), afficheur (P1.A1)
NetP1_B1: board (U10.28), afficheur (P1.B1)
NetP1_B4: board (U10.29), afficheur (P1.B4)
NetP1_B10: board (U10.6), afficheur (P1.B10)
NetP1_B11: board (U10.26), afficheur (P1.B11)
NetP1_B12: board (U10.34), afficheur (P1.B12)
NetR40_2: board (U10.36), afficheur (R40.2)
NetR54_1: board (U10.32), circuit de charge (R54.1 R55.2)
NetU4_23: board (U10.10), commande (U4.23)
NetU4_27: board (U10.30), commande (U4.27)
out1: INPUT_OUTPUT (J6.2), commande (5 pins)
out2: INPUT_OUTPUT (J7.2), commande (5 pins)
out3: INPUT_OUTPUT (J8.2), commande (5 pins)
out4: INPUT_OUTPUT (J9.2), commande (5 pins)
out5: INPUT_OUTPUT (J10.2), commande (5 pins)